# Altium schematic sheet DX-PJ08-V1.1_SCH_Part_AD.SchDoc
size A4
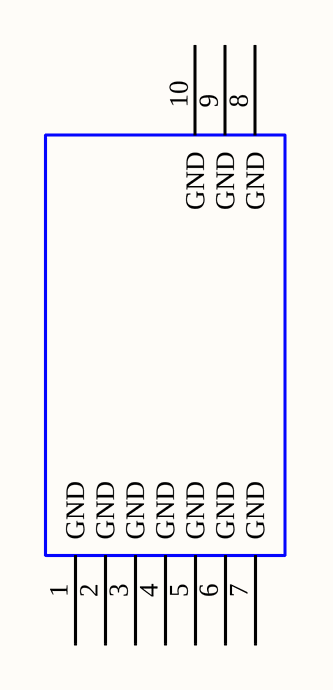
[diagram p0: DX-PJ08-V1.1_SCH_Part_AD.SchDoc]

## Parts
?  (no value)

## Nets

Not connected (* = marked no-connect by the designer): ? 1(GND) 2(GND) 3(GND) 4(GND) 5(GND) 6(GND) 7(GND) 8(GND) 9(GND) 10(GND)

## Library data of the parts
? = Component_1